# Altium schematic sheet RobotPowerSupply.SchDoc
size A4
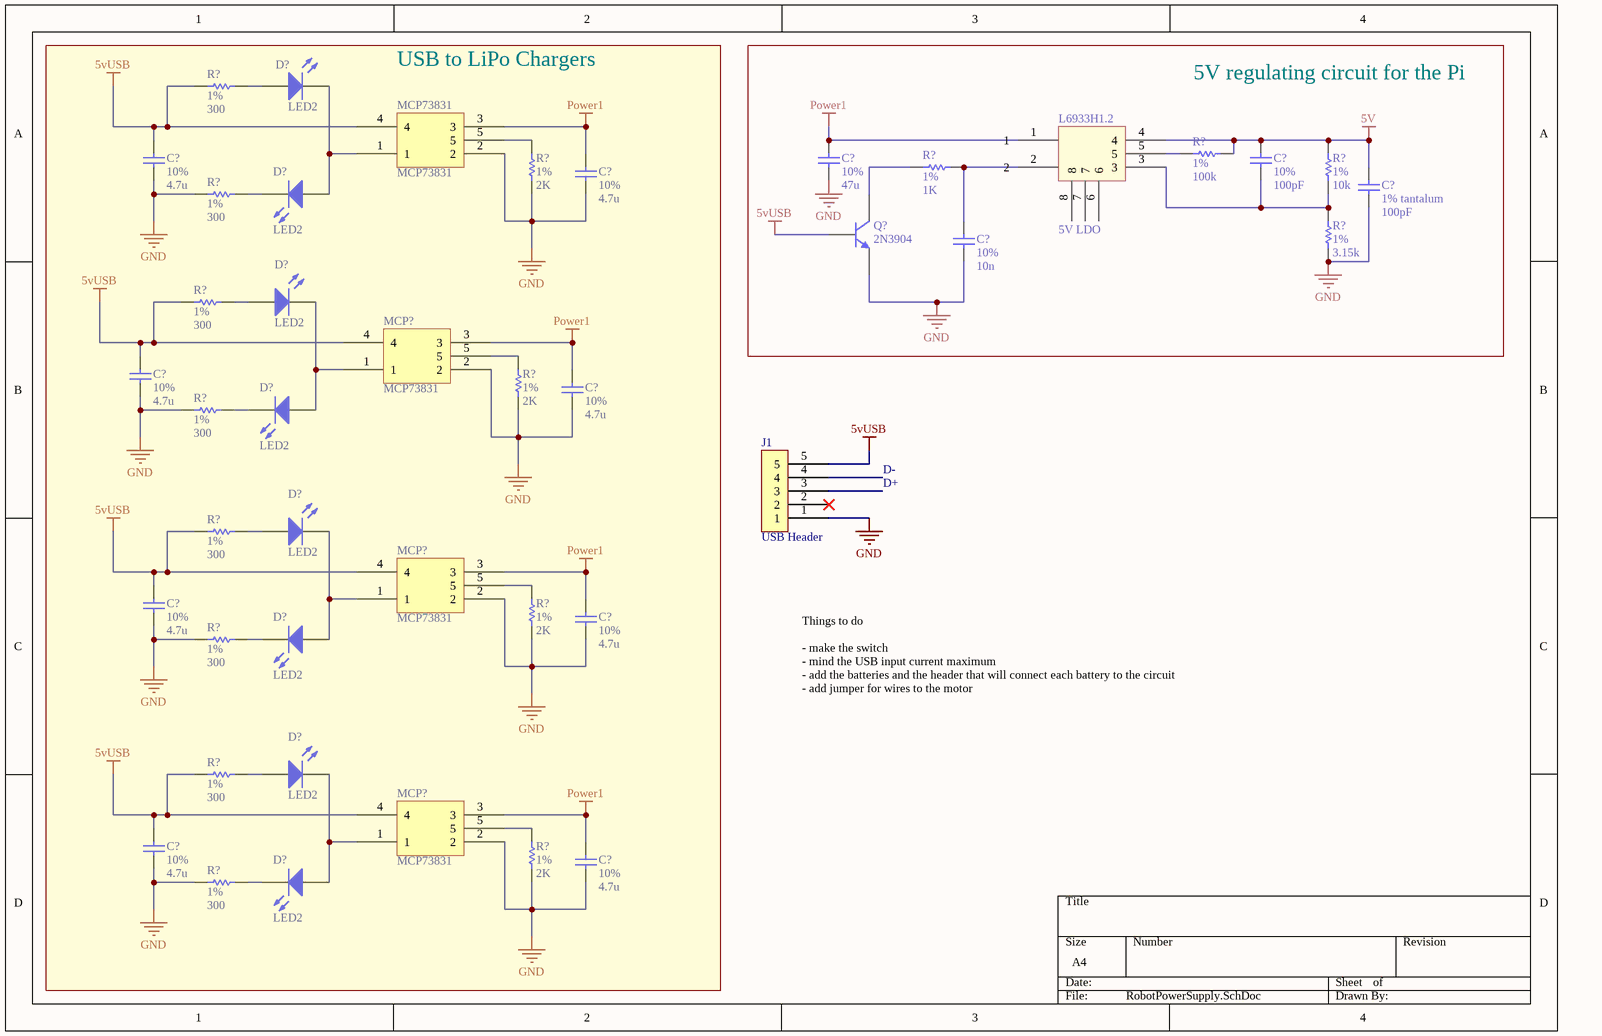
[diagram p0: RobotPowerSupply.SchDoc]

## Parts
(Parts that share a designator on the sheet are numbered #1, #2 ... from top to bottom, then left to right.)
C?#1  10%  value 4.7u  [RAD-0.3]
C?#2  10%  value 47u  [RAD-0.3]
C?#3  10%  value 100pF  [RAD-0.3]
C?#4  10%  value 4.7u  [RAD-0.3]
C?#5  1% tantalum  value 100pF  [RAD-0.3]
C?#6  10%  value 10n  [RAD-0.3]
C?#7  10%  value 4.7u  [RAD-0.3]
C?#8  10%  value 4.7u  [RAD-0.3]
C?#9  10%  value 4.7u  [RAD-0.3]
C?#10  10%  value 4.7u  [RAD-0.3]
C?#11  10%  value 4.7u  [RAD-0.3]
C?#12  10%  value 4.7u  [RAD-0.3]
D?#1  LED2  [3.2X1.6X1.1]
D?#2  LED2  [3.2X1.6X1.1]
D?#3  LED2  [3.2X1.6X1.1]
D?#4  LED2  [3.2X1.6X1.1]
D?#5  LED2  [3.2X1.6X1.1]
D?#6  LED2  [3.2X1.6X1.1]
D?#7  LED2  [3.2X1.6X1.1]
D?#8  LED2  [3.2X1.6X1.1]
J1  USB Header
L6933H1.2  5V LDO
MCP73831  MCP73831
MCP?#1  MCP73831
MCP?#2  MCP73831
MCP?#3  MCP73831
Q?  2N3904  [TO-92A]
R?#1  1%  value 300  [AXIAL-0.3]
R?#2  1%  value 100k  [AXIAL-0.3]
R?#3  1%  value 1K  [AXIAL-0.3]
R?#4  1%  value 300  [AXIAL-0.3]
R?#5  1%  value 2K  [AXIAL-0.3]
R?#6  1%  value 10k  [AXIAL-0.3]
R?#7  1%  value 3.15k  [AXIAL-0.3]
R?#8  1%  value 300  [AXIAL-0.3]
R?#9  1%  value 300  [AXIAL-0.3]
R?#10  1%  value 2K  [AXIAL-0.3]
R?#11  1%  value 300  [AXIAL-0.3]
R?#12  1%  value 300  [AXIAL-0.3]
R?#13  1%  value 2K  [AXIAL-0.3]
R?#14  1%  value 300  [AXIAL-0.3]
R?#15  1%  value 300  [AXIAL-0.3]
R?#16  1%  value 2K  [AXIAL-0.3]

## Blocks framed on the sheet
USB to LiPo Chargers: C?#1 C?#4 C?#7-C?#12 D?#1-D?#8 MCP73831 MCP?#1-MCP?#3 R?#1 R?#4 R?#5 R?#8-R?#16
5V regulating circuit for the Pi: C?#2 C?#3 C?#5 C?#6 L6933H1.2 Q? R?#2 R?#3 R?#6 R?#7

## Nets
5V: C?#3.2 C?#5.2 L6933H1.2.4 R?#2.2 R?#6.2
5vUSB: C?#1.2 C?#7.2 C?#9.2 C?#11.2 J1.5 MCP73831.4 MCP?#1.4 MCP?#2.4 MCP?#3.4 Q?.2(B) R?#1.1 R?#8.1 R?#11.1 R?#14.1
GND: C?#1.1 C?#2.1 C?#4.1 C?#5.1 C?#6.1 C?#7.1 C?#8.1 C?#9.1 C?#10.1 C?#11.1 C?#12.1 J1.1 MCP73831.2 MCP?#1.2 MCP?#2.2 MCP?#3.2 Q?.1(E) R?#4.1 R?#5.1 R?#7.1 R?#9.1 R?#10.1 R?#12.1 R?#13.1 R?#15.1 R?#16.1
Power1: C?#2.2 C?#4.2 C?#8.2 C?#10.2 C?#12.2 MCP73831.3 MCP?#1.3 MCP?#2.3 MCP?#3.3
NetC?#3_1: C?#3.1 L6933H1.2.3 R?#6.1 R?#7.2
NetC?#6_2: C?#6.2 R?#3.2
NetD?#1_1: D?#1.1(A) R?#1.2
NetD?#1_2: D?#1.2(K) D?#2.1(A) MCP73831.1
NetD?#2_2: D?#2.2(K) R?#4.2
NetD?#3_1: D?#3.1(A) R?#8.2
NetD?#3_2: D?#3.2(K) D?#4.1(A) MCP?#1.1
NetD?#4_2: D?#4.2(K) R?#9.2
NetD?#5_1: D?#5.1(A) R?#11.2
NetD?#5_2: D?#5.2(K) D?#6.1(A) MCP?#2.1
NetD?#6_2: D?#6.2(K) R?#12.2
NetD?#7_1: D?#7.1(A) R?#14.2
NetD?#7_2: D?#7.2(K) D?#8.1(A) MCP?#3.1
NetD?#8_2: D?#8.2(K) R?#15.2
NetL6933H1.2_5: L6933H1.2.5 R?#2.1
NetMCP73831_5: MCP73831.5 R?#5.2
NetMCP?#1_5: MCP?#1.5 R?#10.2
NetMCP?#2_5: MCP?#2.5 R?#13.2
NetMCP?#3_5: MCP?#3.5 R?#16.2
NetQ?_3: Q?.3(C) R?#3.1

Not connected (* = marked no-connect by the designer): J1 2* 3 4; L6933H1.2 1 2 6 7 8

## Notes on the sheet
- D-
- D+
- Things to do
  - make the switch
  - mind the USB input current maximum
  - add the batteries and the header that will connect each battery to the circuit
  - add jumper for wires to the motor

## Library data of the parts
C?#1-C?#12 = Cap: Capacitor; Published: 8-Jun-2000; LatestRevisionDate: 17-Jul-2002; LatestRevisionNote: Re-released for DXP Platform.; PackageReference: RAD-0.3; Publisher: Altium Limited; PackageDescription: Radial Cap, Thru-Hole; 2 Leads; 0.3 in Pin Spacing
D?#1-D?#8 = LED2: Typical RED, GREEN, YELLOW, AMBER GaAs LED; Published: 8-Jun-2000; LatestRevisionDate: 17-Jul-2002; LatestRevisionNote: Re-released for DXP Platform.; PackageVersion: Feb-2002; PackageReference: 3.2X1.6X1.1; Publisher: Altium Limited; PackageDescription: SM LED; 2 Flat Leads
MCP73831 MCP?#1-MCP?#3 = MCP73831: LiPo Charging Controller
Q? = 2N3904: NPN General Purpose Amplifier; Published: 8-Jun-2000; LatestRevisionDate: 15-Jan-2003; LatestRevisionNote: PCB Footprint 'BCY-W3/D4.7' replaced; DatasheetVersion: 1997; PackageVersion: Sep-1998; PackageReference: TO-92A; Publisher: Altium Limited; PackageDescription: TO, Flat Index; 3 In-Line, Axial Leads; Body Dia. 4.5mm; Leads 0.51 x 0.48 mm (max); ComponentLink1Description: Manufacturer Link; ComponentLink1URL: http://www.fairchildsemi.com/; ComponentLink2Description: Datasheet; ComponentLink2URL: http://www.fairchildsemi.com/ds/2N%2F2N3904.pdf
R?#1-R?#16 = Res1: Resistor; Published: 8-Jun-2000; LatestRevisionDate: 17-Jul-2002; LatestRevisionNote: Re-released for DXP Platform.; PackageReference: AXIAL-0.3; Publisher: Altium Limited; PackageDescription: Axial Device, Thru-Hole; 2 Leads; 0.3 in Pin Spacing